# Altium project Karaoke.PrjPcb
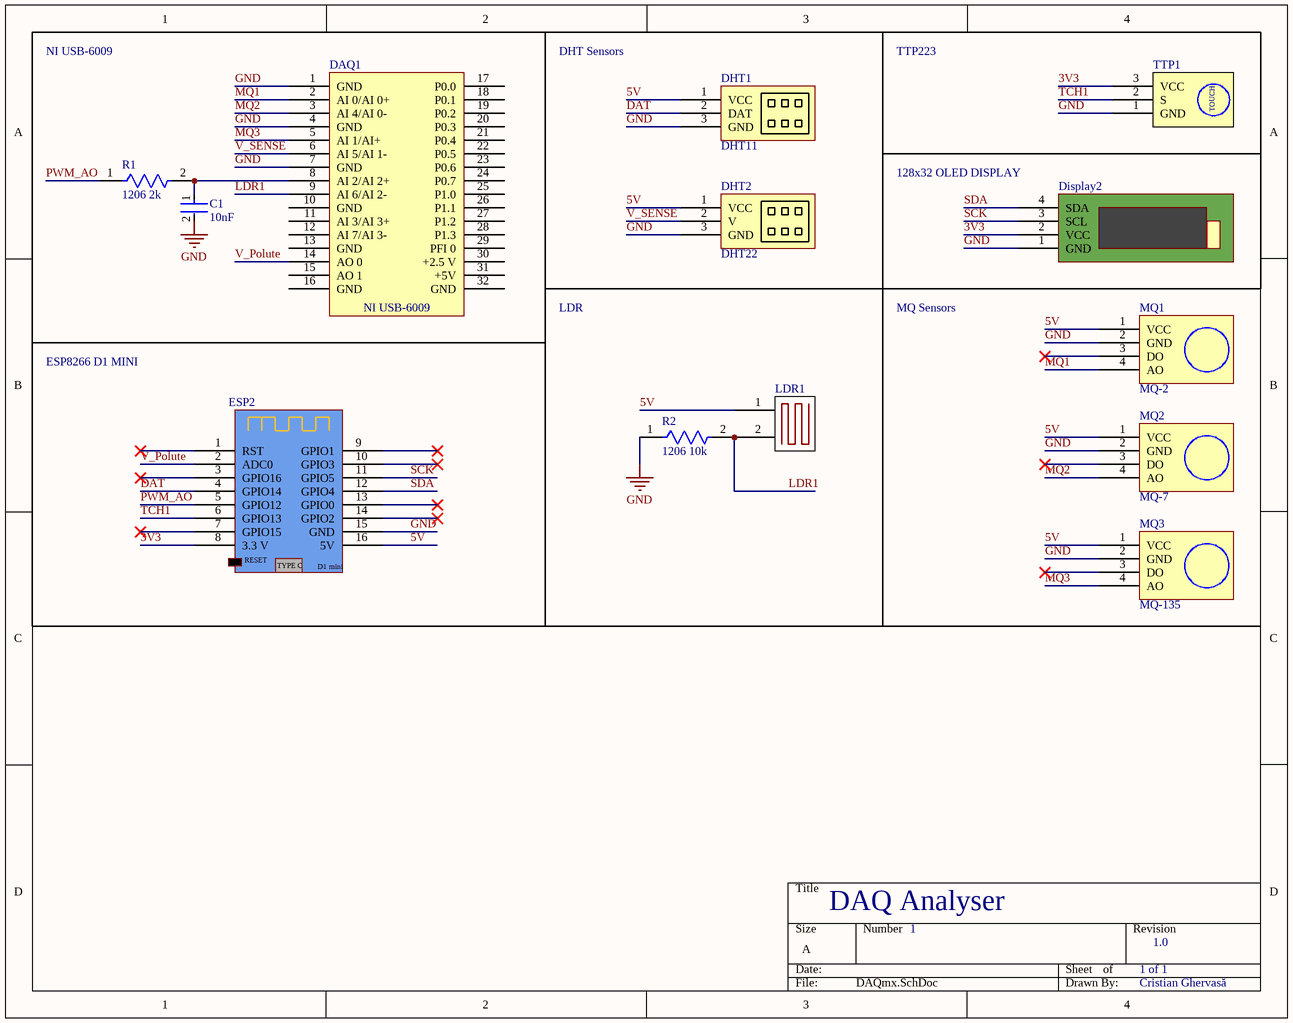
[diagram p0: DAQmx.SchDoc]
1 sheet, 13 parts. Net scope: global (net labels, ports and power ports of the same name join across sheets).
Board files: PCB1.PcbDoc, IoT_Labview.PcbDoc

## Sheet DAQmx.SchDoc
size A; SheetNumber: 1; SheetTotal: 1

### Parts
C1  10nF  [FP-C1206C-EB-MFG]
DAQ1  NI USB-6009  [NI USB-6009]
DHT1  DHT11  [DHT22]
DHT2  DHT22  [DHT22]
Display2  128x32 OLED DISPLAY  [128x32 OLED Display]
ESP2  ESP8266 D1 MINI  [ESP8266 D1 Mini]
LDR1  LDR  [LDR]
MQ1  MQ-2  [MQ-135]
MQ2  MQ-7  [MQ-135]
MQ3  MQ-135  [MQ-135]
R1  1206 2k  [FP-TFCR1206-IPC_B]
R2  1206 10k  [FP-CRGCQ1206-IPC_C]
TTP1  TTP223  [TTP223]

### Nets
GND: C1.2 DAQ1.1(GND) DAQ1.4(GND) DAQ1.7(GND) DHT1.3(GND) DHT2.3(GND) Display2.1(GND) ESP2.15(GND) MQ1.2(GND) MQ2.2(GND) MQ3.2(GND) R2.1 TTP1.1(GND)
3V3: Display2.2(VCC) ESP2.8(3.3_V) TTP1.3(VCC)
5V: DHT1.1(VCC) DHT2.1(VCC) ESP2.16(5V) LDR1.1 MQ1.1(VCC) MQ2.1(VCC) MQ3.1(VCC)
DAT: DHT1.2(DAT) ESP2.4(GPIO14)
LDR1: DAQ1.9(AI_6/AI_2-) LDR1.2 R2.2
MQ1: DAQ1.2(AI_0/AI_0+) MQ1.4(AO)
MQ2: DAQ1.3(AI_4/AI_0-) MQ2.4(AO)
MQ3: DAQ1.5(AI_1/AI+) MQ3.4(AO)
PWM_AO: ESP2.5(GPIO12) R1.1
SCK: Display2.3(SCL) ESP2.11(GPIO5)
SDA: Display2.4(SDA) ESP2.12(GPIO4)
TCH1: ESP2.6(GPIO13) TTP1.2(S)
V_Polute: DAQ1.14(AO_0) ESP2.2(ADC0)
V_SENSE: DAQ1.6(AI_5/AI_1-) DHT2.2(V)
NetC1_1: C1.1 DAQ1.8(AI_2/AI_2+) R1.2

Not connected (* = marked no-connect by the designer): DAQ1 10(GND) 11(AI_3/AI_3+) 12(AI_7/AI_3-) 13(GND) 15(AO_1) 16(GND) 17(P0.0) 18(P0.1) 19(P0.2) 20(P0.3) 21(P0.4) 22(P0.5) 23(P0.6) 24(P0.7) 25(P1.0) 26(P1.1) 27(P1.2) 28(P1.3) 29(PFI_0) 30(+2.5_V) 31(+5V) 32(GND); ESP2 1(RST)* 3(GPIO16)* 7(GPIO15)* 9(GPIO1)* 10(GPIO3)* 13(GPIO0)* 14(GPIO2)*; MQ1 3(DO)*; MQ2 3(DO)*; MQ3 3(DO)*

### Notes on the sheet
- DHT Sensors
- MQ Sensors
- DAQ Analyser
- 1
- 1 of 1
- 1.0
- Cristian Ghervasă
- (in symbol ESP8266 D1 MINI) RESET; TYPE C; D1 mini
- (in symbol TTP223) TOUCH

### Library data of the parts
C1 = CMP-03020-033994-1: C1206 10,000 pF C0G 5.00% 50 V; Manufacturer: KEMET; Manufacturer Part Number: C1206C103J5GACAUTO; Material: Ceramic; Temperature Coefficient: 15%; Automotive Grade: Grade 0; Voltage Rating: 50 V; Tolerance: 0.05; Value: 10,000 pF; Height: 0.88mm; Octopart: https://octopart.com/c1206c103j5gacauto-kemet-88376196; Device Class L2: Capacitors; Device Class L1: Passive Components; Temperature Characteristic: C0G; Package: C1206C-EB; Temperature Range High: +150°C; ComponentLink2Description: Datasheet; Temperature: -55°C to +150°C; Lead Free: Yes; Ipc Land Pattern Name: CAPC320160X78; RoHS: TRUE; Temperature Range Low: -55°C; ComponentLink2URL: https://content.kemet.com/datasheets/KEM_C1007_X8R_ULTRA_150C_SMD.pdf; Device Class L3: Ceramic Capacitors; Category: Cap; Capacitance: 10,000 pF; Automotive: Yes
R1 = CMP-250906-277321-1: RES Thin Film, 2kΩ, 0.1%, 0.25W, 25ppm/°C, 1206
R2 = CMP-03211-010884-1: CRGCQ1206 10KΩ 0.25W 1% ±100ppm/°C 200V; Manufacturer: TE Connectivity; Manufacturer Part Number: CRGCQ1206F10K; Tolerance: 0.01; Automotive Grade: Grade 913; Value: 10KΩ; Automotive: Yes; Temperature: -55°C to +155°C; RoHS: TRUE; Series: CRGCQ; Lead Free: Yes; Device Class L3: Chip SMD Resistors; Package: CRGCQ1206; ComponentLink2URL: https://www.te.com/commerce/DocumentDelivery/DDEController?Action=showdoc&DocId=Data+Sheet%7F1773204-3%7F1%7Fpdf%7FEnglish%7FENG_DS_1773204-3_1.pdf%7F4-2176347-922; Ipc Land Pattern Name: RESC310155X55; Composition: Thick Film; Voltage Rating: 200V; Device Class L1: Passive Components; Temperature Range Low: -55°C; Resistance: 10KΩ; Height: 0.65mm; Power Rating: 0.25W; Device Class L2: Resistors; Temperature Range High: +155°C; Octopart: https://octopart.com/crgcq1206f10k-te+connectivity-91018244; Ambient Temperature Range High: +70°C; ComponentLink2Description: Datasheet; Temperature Coefficient: ±100ppm/°C; Category: Res